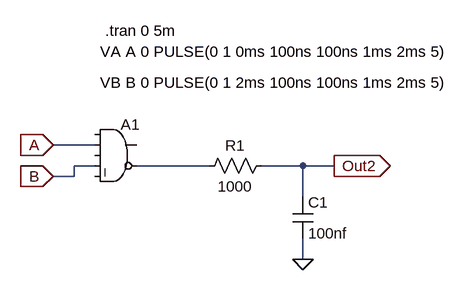
[diagram p0: schematic Lab2Part2.asc]
Lab2Part2.asc, the LTspice schematic file:
Version 4
SHEET 1 880 680
WIRE 32 160 -32 160
WIRE 32 192 0 192
WIRE 208 192 96 192
WIRE 352 192 288 192
WIRE 400 192 352 192
WIRE 0 208 0 192
WIRE 0 208 -32 208
WIRE 352 240 352 192
WIRE 352 336 352 304
FLAG -32 160 A
IOPIN -32 160 In
FLAG -32 208 B
IOPIN -32 208 In
FLAG 400 192 Out2
IOPIN 400 192 Out
FLAG 352 336 0
SYMBOL res 304 176 R90
WINDOW 0 0 56 VBottom 2
WINDOW 3 32 56 VTop 2
SYMATTR InstName R1
SYMATTR Value 1000
SYMBOL cap 336 240 R0
SYMATTR InstName C1
SYMATTR Value 100nf
SYMBOL Digital\\and 64 112 R0
SYMATTR InstName A1
TEXT 40 64 Left 2 !VB B 0 PULSE(0 1 2ms 100ns 100ns 1ms 2ms 5)
TEXT 40 16 Left 2 !VA A 0 PULSE(0 1 0ms 100ns 100ns 1ms 2ms 5)
TEXT 48 -16 Left 2 !.tran 0 5m

The netlist it stands for:
* Lab2Part2.asc
R1 Out2 N001 1000
C1 Out2 0 100nf
A1 0 A 0 B 0 N001 0 0 AND
VB B 0 PULSE(0 1 2ms 100ns 100ns 1ms 2ms 5)
VA A 0 PULSE(0 1 0ms 100ns 100ns 1ms 2ms 5)
.tran 0 5m
.backanno
.end

* Results of the author's LTspice run, read from the files saved beside the schematic
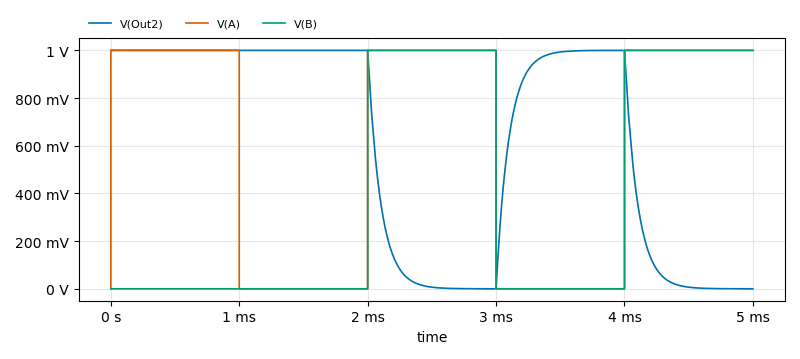
[diagram p1: Transient Analysis of Lab2Part2.asc, plotted from the saved traces]
* Transient Analysis, 1 run:
*   V(Out2): min 45.72 µV, max 1 V, average 620.2 mV, rms 768.4 mV, last 45.79 µV
*   V(A): min 0 V, max 1 V, average 600 mV, rms 774.6 mV, last 1 V
*   V(B): min 0 V, max 1 V, average 400 mV, rms 632.5 mV, last 1 V